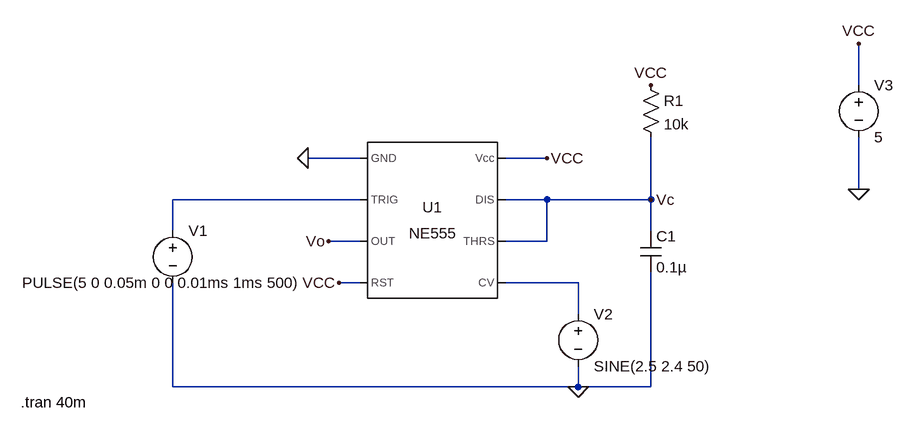
[diagram p0: schematic PWM.asc]
PWM.asc, the LTspice schematic file:
Version 4
SHEET 1 952 680
WIRE 896 -48 896 -112
WIRE 128 64 48 64
WIRE 416 64 352 64
WIRE 896 112 896 32
WIRE 128 128 -160 128
WIRE 416 128 352 128
WIRE 576 128 576 32
WIRE 576 128 416 128
WIRE -160 176 -160 128
WIRE 576 176 576 128
WIRE 128 192 80 192
WIRE 416 192 416 128
WIRE 416 192 352 192
WIRE 128 256 96 256
WIRE 464 256 352 256
WIRE 464 304 464 256
WIRE -160 416 -160 256
WIRE 464 416 464 384
WIRE 464 416 -160 416
WIRE 576 416 576 240
WIRE 576 416 464 416
FLAG 896 112 0
FLAG 896 -112 VCC
FLAG 416 64 VCC
FLAG 48 64 0
FLAG 96 256 VCC
FLAG 80 192 Vo
FLAG 576 -48 VCC
FLAG 576 128 Vc
FLAG 464 416 0
SYMBOL Misc\\NE555 240 160 R0
SYMATTR InstName U1
SYMBOL voltage -160 160 R0
WINDOW 3 -232 96 Left 2
WINDOW 123 0 0 Left 0
WINDOW 39 0 0 Left 0
SYMATTR InstName V1
SYMATTR Value PULSE(5 0 0.05m 0 0 0.01ms 1ms 500)
SYMBOL voltage 464 288 R0
WINDOW 123 0 0 Left 0
WINDOW 39 0 0 Left 0
SYMATTR InstName V2
SYMATTR Value SINE(2.5 2.4 50)
SYMBOL voltage 896 -64 R0
WINDOW 123 0 0 Left 0
WINDOW 39 0 0 Left 0
SYMATTR InstName V3
SYMATTR Value 5
SYMBOL res 560 -64 R0
SYMATTR InstName R1
SYMATTR Value 10k
SYMBOL cap 560 176 R0
SYMATTR InstName C1
SYMATTR Value 0.1µ
TEXT -394 440 Left 2 !.tran 40m

The netlist it stands for:
* PWM.asc
XU1 0 N001 Vo VCC N002 Vc Vc VCC NE555  ; pins GND TRIG OUT RST CV THRS DIS Vcc
V1 N001 0 PULSE(5 0 0.05m 0 0 0.01ms 1ms 500)
V2 N002 0 SINE(2.5 2.4 50)
V3 VCC 0 5
R1 VCC Vc 10k
C1 Vc 0 0.1µ
.tran 40m
.lib NE555.sub
.backanno
.end